# Altium schematic sheet Indicators & Buttons.SchDoc
size A4; SheetNumber: 8; SheetTotal: 9
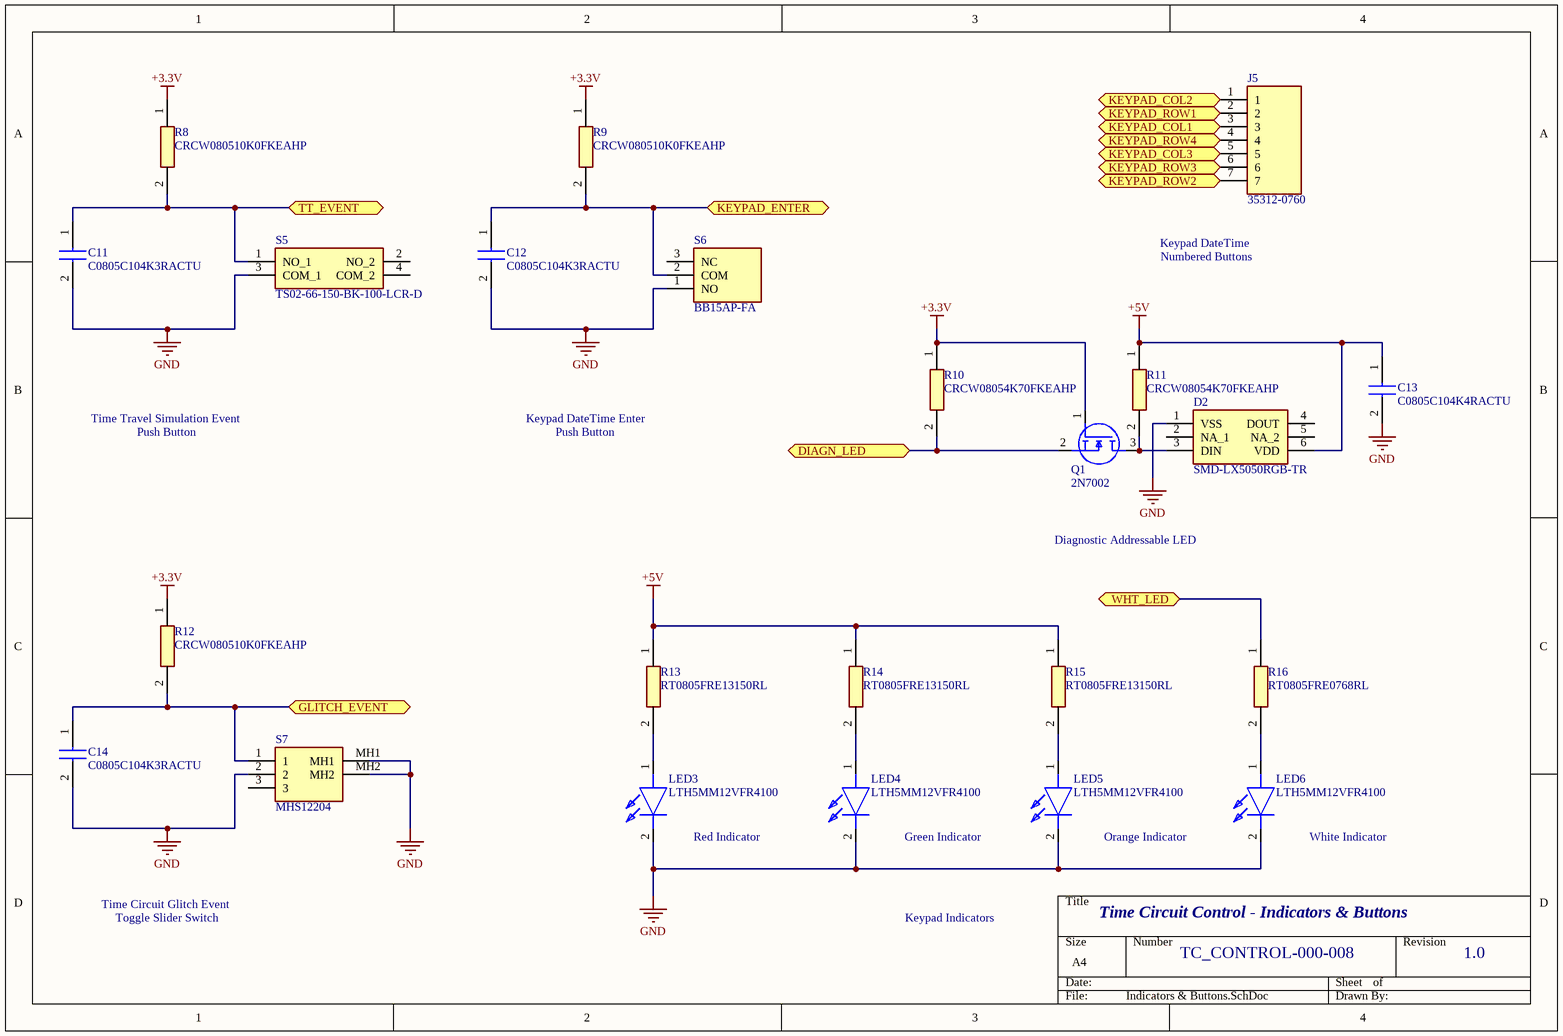
[diagram p0: Indicators & Buttons.SchDoc]

## Parts
C11  C0805C104K3RACTU  [CAPC2012X88N]
C12  C0805C104K3RACTU  [CAPC2012X88N]
C13  C0805C104K4RACTU  [CAPC2012X88N]
C14  C0805C104K3RACTU  [CAPC2012X88N]
D2  SMD-LX5050RGB-TR  [SMDLX5050RGBTR]
J5  35312-0760  [SHDR7W64P0X250_1X7_1996X650X700P]
LED3  LTH5MM12VFR4100  [LTH5MM12VFR4100]
LED4  LTH5MM12VFR4100  [LTH5MM12VFR4100]
LED5  LTH5MM12VFR4100  [LTH5MM12VFR4100]
LED6  LTH5MM12VFR4100  [LTH5MM12VFR4100]
Q1  2N7002  [SOT96P240X120-3N]
R8  CRCW080510K0FKEAHP  [RESC2012X60N]
R9  CRCW080510K0FKEAHP  [RESC2012X60N]
R10  CRCW08054K70FKEAHP  [RESC2012X50N]
R11  CRCW08054K70FKEAHP  [RESC2012X50N]
R12  CRCW080510K0FKEAHP  [RESC2012X60N]
R13  RT0805FRE13150RL  [RESC2012X60N]
R14  RT0805FRE13150RL  [RESC2012X60N]
R15  RT0805FRE13150RL  [RESC2012X60N]
R16  RT0805FRE0768RL  [RESC2012X60N]
S5  TS02-66-150-BK-100-LCR-D  [TS0266150BK100LCRD]
S6  BB15AP-FA  [BB15APFA]
S7  MHS12204  [MHS12204]

## Ports
DIAGN_LED, GLITCH_EVENT, KEYPAD_COL1, KEYPAD_COL2, KEYPAD_COL3, KEYPAD_ENTER, KEYPAD_ROW1, KEYPAD_ROW2, KEYPAD_ROW3, KEYPAD_ROW4, TT_EVENT, WHT_LED

## Nets
+3.3V: Q1.1(G) R8.1 R9.1 R10.1 R12.1
+5V: C13.1 D2.6(VDD) R11.1 R13.1 R14.1 R15.1
GND: C11.2 C12.2 C13.2 C14.2 D2.1(VSS) LED3.2(K) LED4.2(K) LED5.2(K) LED6.2(K) S5.3(COM_1) S6.1(NO) S7.2 S7.MH1 S7.MH2
DIAGN_LED: Q1.2(S) R10.2 ; port DIAGN_LED
GLITCH_EVENT: C14.1 R12.2 S7.1 ; port GLITCH_EVENT
KEYPAD_COL1: J5.3 ; port KEYPAD_COL1
KEYPAD_COL2: J5.1 ; port KEYPAD_COL2
KEYPAD_COL3: J5.5 ; port KEYPAD_COL3
KEYPAD_ENTER: C12.1 R9.2 S6.2(COM) ; port KEYPAD_ENTER
KEYPAD_ROW1: J5.2 ; port KEYPAD_ROW1
KEYPAD_ROW2: J5.7 ; port KEYPAD_ROW2
KEYPAD_ROW3: J5.6 ; port KEYPAD_ROW3
KEYPAD_ROW4: J5.4 ; port KEYPAD_ROW4
TT_EVENT: C11.1 R8.2 S5.1(NO_1) ; port TT_EVENT
WHT_LED: R16.1 ; port WHT_LED
NetD2_3: D2.3(DIN) Q1.3(D) R11.2
NetLED3_1: LED3.1(A) R13.2
NetLED4_1: LED4.1(A) R14.2
NetLED5_1: LED5.1(A) R15.2
NetLED6_1: LED6.1(A) R16.2

Not connected (* = marked no-connect by the designer): D2 2(NA_1) 4(DOUT) 5(NA_2); S5 2(NO_2) 4(COM_2); S6 3(NC); S7 3

## Notes on the sheet
- Keypad DateTime
  Numbered Buttons
- Time Travel Simulation Event
  Push Button
- Keypad DateTime Enter
  Push Button
- Diagnostic Addressable LED
- (near LED3) Red Indicator
- (near LED4) Green Indicator
- (near LED5) Orange Indicator
- (near LED6) White Indicator
- Time Circuit Control - Indicators & Buttons
- Time Circuit Glitch Event
  Toggle Slider Switch
- Keypad Indicators
- TC_CONTROL-000-008
- 1.0

## Library data of the parts
C11 C12 C14 = C0805C104K3RACTU: Capacitor; Manufacturer_Name: Kemet; Datasheet Link: https://componentsearchengine.com/Datasheets/2/C0805C104K3RACTU.pdf; Height: 0.88mm; Manufacturer_Part_Number: C0805C104K3RACTU; Mouser Part Number: 80-C0805C104K3R; Mouser Price/Stock: https://www.mouser.co.uk/ProductDetail/KEMET/C0805C104K3RACTU?qs=zZwvocWqSRjmUvfNxkIN%2Fg%3D%3D; Arrow Part Number: C0805C104K3RACTU; Arrow Price/Stock: https://www.arrow.com/en/products/c0805c104k3ractu/kemet-corporation
C13 = C0805C104K4RACTU: Capacitor; Manufacturer_Name: Kemet; Datasheet Link: http://docs-emea.rs-online.com/webdocs/134c/0900766b8134ce68.pdf; Height: 0.88mm; Manufacturer_Part_Number: C0805C104K4RACTU; Arrow Part Number: C0805C104K4RACTU; Arrow Price/Stock: https://www.arrow.com/en/products/c0805c104k4ractu/kemet-corporation; Mouser Part Number: 80-C0805C104K4R; Mouser Price/Stock: https://www.mouser.co.uk/ProductDetail/KEMET/C0805C104K4RACTU?qs=Pc30aiB8zWWfqQNJWggt%252BA%3D%3D
D2 = SMD-LX5050RGB-TR: Diode; Manufacturer_Name: Lumex; Datasheet Link: https://www.lumex.com/datasheet/SMD-LX5050RGB-TR.html; Height: 1.5mm; Manufacturer_Part_Number: SMD-LX5050RGB-TR; Mouser Part Number: 696-SMDLX5050RGBTR; Mouser Price/Stock: https://www.mouser.co.uk/ProductDetail/Lumex/SMD-LX5050RGB-TR?qs=GedFDFLaBXGgyFR6XtWXMw%3D%3D; Arrow Part Number: SMD-LX5050RGB-TR; Arrow Price/Stock: https://www.arrow.com/en/products/smd-lx5050rgb-tr/lumex?region=nac
J5 = 35312-0760: Connector; Manufacturer_Name: Molex; Datasheet Link: https://www.molex.com/pdm_docs/sd/353120760_sd.pdf; Height: 7mm; Manufacturer_Part_Number: 35312-0760; Mouser Part Number: 538-35312-0760; Mouser Price/Stock: https://www.mouser.co.uk/ProductDetail/Molex/35312-0760?qs=yk4OKw9K9iL5%2Fs1BGO8uUw%3D%3D
LED3-LED6 = LTH5MM12VFR4100: LED; Manufacturer_Name: Visual Communications Company; Datasheet Link: https://componentsearchengine.com/Datasheets/2/LTH5MM12VFR4100.pdf; Height: 9.95mm; Manufacturer_Part_Number: LTH5MM12VFR4100; Mouser Part Number: 593-LTH5MM12VFR4100; Mouser Price/Stock: https://www.mouser.co.uk/ProductDetail/VCC/LTH5MM12VFR4100?qs=Mv7BduZupUjLdcSJg07%2F1g%3D%3D
Q1 = 2N7002: MOSFET (N-Channel); Manufacturer_Name: Vishay; Datasheet Link: https://www.diodes.com/assets/Datasheets/ds11303.pdf; Height: 1.2mm; Manufacturer_Part_Number: 2N7002; Mouser Part Number: 781-2N7002; Mouser Price/Stock: https://www.mouser.co.uk/ProductDetail/Vishay-Siliconix/2N7002?qs=xBpwZ0JX2zKeuvZKtdYLZQ%3D%3D
R8 R9 R12 = CRCW080510K0FKEAHP: Resistor; Manufacturer_Name: Vishay; Datasheet Link: https://componentsearchengine.com/Datasheets/1/CRCW08051R00FKEAHP.pdf; Height: 0.6mm; Manufacturer_Part_Number: CRCW080510K0FKEAHP; Mouser Part Number: 71-CRCW080510K0FKEAH; Mouser Price/Stock: https://www.mouser.co.uk/ProductDetail/Vishay-Dale/CRCW080510K0FKEAHP/?qs=FlFvgi4rxBybVOW6oiRQjA%3D%3D; Arrow Part Number: CRCW080510K0FKEAHP; Arrow Price/Stock: https://www.arrow.com/en/products/crcw080510k0fkeahp/vishay
R10 R11 = CRCW08054K70FKEAHP: Resistor; Manufacturer_Name: Vishay; Datasheet Link: http://uk.rs-online.com/web/p/products/8123574; Height: 0.5mm; Manufacturer_Part_Number: CRCW08054K70FKEAHP; Arrow Part Number: CRCW08054K70FKEAHP; Arrow Price/Stock: https://www.arrow.com/en/products/crcw08054k70fkeahp/vishay; Mouser Part Number: 71-CRCW08054K70FKEAH; Mouser Price/Stock: https://www.mouser.com/Search/Refine.aspx?Keyword=71-CRCW08054K70FKEAH
R13-R15 = RT0805FRE13150RL: Resistor; Manufacturer_Name: KEMET; Datasheet Link: https://www.mouser.in/datasheet/2/447/PYu-RT_1-to-0.01_RoHS_L_11-1669912.pdf; Height: 0.6mm; Manufacturer_Part_Number: RT0805FRE13150RL; Mouser Part Number: 603-RT0805FRE13150RL; Mouser Price/Stock: https://www.mouser.co.uk/ProductDetail/Yageo/RT0805FRE13150RL?qs=peXyjxmEyvsJNyiYkUNugw%3D%3D
R16 = RT0805FRE0768RL: Resistor; Manufacturer_Name: KEMET; Datasheet Link: https://www.yageo.com/upload/media/product/productsearch/datasheet/rchip/PYu-RT_1-to-0.01_RoHS_L_11.pdf; Height: 0.6mm; Manufacturer_Part_Number: RT0805FRE0768RL; Mouser Part Number: 603-RT0805FRE0768RL; Mouser Price/Stock: https://www.mouser.co.uk/ProductDetail/Yageo/RT0805FRE0768RL?qs=yNCrj0CQcyKh6OmIHtX6fQ%3D%3D
S5 = TS02-66-150-BK-100-LCR-D: Integrated Circuit; Manufacturer_Name: CUI Inc.; Datasheet Link: https://www.cuidevices.com/product/resource/ts02.pdf; Height: 15.2mm; Manufacturer_Part_Number: TS02-66-150-BK-100-LCR-D; Mouser Part Number: 179-TS0266150BK100LC; Mouser Price/Stock: https://www.mouser.co.uk/ProductDetail/CUI-Devices/TS02-66-150-BK-100-LCR-D?qs=A6eO%252BMLsxmTmMEK2h9yrsA%3D%3D; Arrow Part Number: TS02-66-150-BK-100-LCR-D; Arrow Price/Stock: https://www.arrow.com/en/products/ts02-66-150-bk-100-lcr-d/cui-devices?region=nac
S6 = BB15AP-FA: Switch; Manufacturer_Name: NKK Switches; Datasheet Link: http://www.nkkswitches.com/pdf/Bpushbuttons-1.pdf; Height: 19.4mm; Manufacturer_Part_Number: BB15AP-FA; Mouser Part Number: 633-BB15AP-FA; Mouser Price/Stock: https://www.mouser.co.uk/ProductDetail/NKK-Switches/BB15AP-FA?qs=UTbEi1DBCno08sfAzv%2F1qA%3D%3D; Arrow Part Number: BB15AP-FA; Arrow Price/Stock: https://www.arrow.com/en/products/bb15ap-fa/nkk-switches
S7 = MHS12204: Switch; Manufacturer_Name: TE Connectivity; Datasheet Link: https://www.te.com/commerce/DocumentDelivery/DDEController?Action=srchrtrv&DocNm=1825255&DocType=Customer+Drawing&DocLang=English&DocFormat=pdf&PartCntxt=1825255-1; Height: 12mm; Manufacturer_Part_Number: MHS12204; Mouser Part Number: 506-MHS12204; Mouser Price/Stock: https://www.mouser.co.uk/ProductDetail/TE-Connectivity-Alcoswitch/MHS12204?qs=x%2FgbKjZ2T%2FPUluB%2FWhqq0Q%3D%3D; Arrow Part Number: MHS12204; Arrow Price/Stock: https://www.arrow.com/en/products/mhs12204/te-connectivity?region=nac